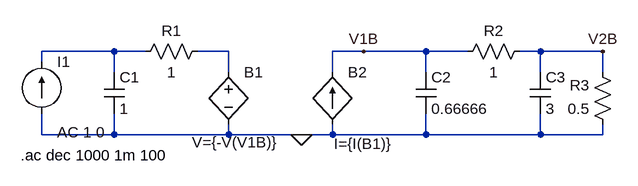
[diagram p0: schematic ej11.asc]
ej11.asc, the LTspice schematic file:
Version 4
SHEET 1 880 680
WIRE 48 64 -64 64
WIRE 96 64 48 64
WIRE 224 64 176 64
WIRE 432 64 384 64
WIRE 528 64 432 64
WIRE 592 64 528 64
WIRE 704 64 672 64
WIRE 800 64 704 64
WIRE -64 80 -64 64
WIRE 48 96 48 64
WIRE 224 96 224 64
WIRE 384 96 384 64
WIRE 528 96 528 64
WIRE 704 96 704 64
WIRE 800 96 800 64
WIRE -64 192 -64 160
WIRE 48 192 48 160
WIRE 48 192 -64 192
WIRE 224 192 224 176
WIRE 224 192 48 192
WIRE 336 192 224 192
WIRE 384 192 384 176
WIRE 384 192 336 192
WIRE 528 192 528 160
WIRE 528 192 384 192
WIRE 704 192 704 160
WIRE 704 192 528 192
WIRE 800 192 800 176
WIRE 800 192 704 192
FLAG 432 64 V1B
FLAG 336 192 0
FLAG 800 64 V2B
SYMBOL cap 32 96 R0
SYMATTR InstName C1
SYMATTR Value 1
SYMBOL res 80 80 R270
WINDOW 0 32 56 VTop 2
WINDOW 3 0 56 VBottom 2
SYMATTR InstName R1
SYMATTR Value 1
SYMBOL bv 224 80 R0
WINDOW 3 -56 124 Left 2
SYMATTR Value V={-V(V1B)}
SYMATTR InstName B1
SYMBOL bi2 384 96 R0
WINDOW 3 2 110 Left 2
SYMATTR Value I={I(B1)}
SYMATTR InstName B2
SYMBOL cap 512 96 R0
SYMATTR InstName C2
SYMATTR Value 0.66666
SYMBOL res 688 48 R90
WINDOW 0 0 56 VBottom 2
WINDOW 3 32 56 VTop 2
SYMATTR InstName R2
SYMATTR Value 1
SYMBOL res 816 192 R180
WINDOW 0 36 76 Left 2
WINDOW 3 36 40 Left 2
SYMATTR InstName R3
SYMATTR Value 0.5
SYMBOL cap 688 96 R0
SYMATTR InstName C3
SYMATTR Value 3
SYMBOL current -64 160 M180
WINDOW 0 24 80 Left 2
WINDOW 3 24 0 Left 2
WINDOW 123 24 -28 Left 2
WINDOW 39 0 0 Left 0
SYMATTR InstName I1
SYMATTR Value ""
SYMATTR Value2 AC 1 0
TEXT -96 224 Left 2 !.ac dec 1000 1m 100

The netlist it stands for:
* ej11.asc
C1 N001 0 1
R1 N001 N002 1
B1 N002 0 V={-V(V1B)}
B2 0 V1B I={I(B1)}
C2 V1B 0 0.66666
R2 V2B V1B 1
R3 0 V2B 0.5
C3 V2B 0 3
I1 0 N001 AC 1 0
.ac dec 1000 1m 100
.backanno
.end